# EAGLE design LED_servo_board (EAGLE 8.3.1)
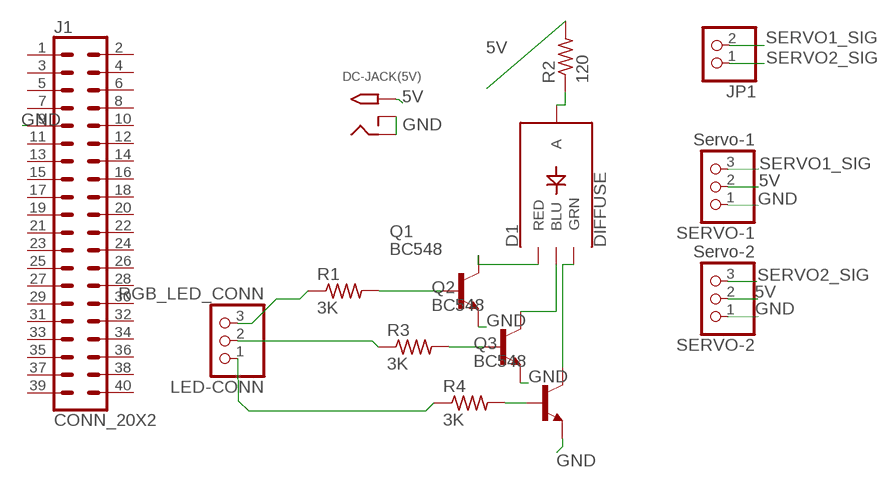
[diagram p0: schematic, sheet 1]

## Parts
D1  DIFFUSE  LED-RGB-CADIFFUSE  [LED-RGB-THRU]
DC-JACK(5V)  2.1MMJACKTHM  [PJ-102A]
J1  CONN_20X2  [2X20]
JP1  PINHD-1X2  [1X02]
LED-CONN  RGB_LED_CONN  PINHD-1X3  [1X03]
Q1  BC548  [TO92-EBC]
Q2  BC548  [TO92-EBC]
Q3  BC548  [TO92-EBC]
R1  3K  R-US_0204/5  [0204/5]
R2  120  R-US_0204/5  [0204/5]
R3  3K  R-US_0204/5  [0204/5]
R4  3K  R-US_0204/5  [0204/5]
SERVO-1  Servo-1  PINHD-1X3  [1X03]
SERVO-2  Servo-2  PINHD-1X3  [1X03]

## Nets
5V: DC-JACK(5V).TIP R2.2 SERVO-1.2 SERVO-2.2
GND: DC-JACK(5V).RING DC-JACK(5V).RING_SW J1.9 Q1.E Q2.E Q3.E SERVO-1.1 SERVO-2.1
N$1: Q1.B R1.2
N$2: Q2.B R3.2
N$3: Q3.B R4.2
N$4: D1.1(RED) Q1.C
N$5: D1.4(BLU) Q2.C
N$6: D1.3(GRN) Q3.C
N$7: D1.2(A) R2.1
N$8: LED-CONN.3 R1.1
N$9: LED-CONN.2 R3.1
N$10: LED-CONN.1 R4.1
SERVO1_SIG: JP1.2 SERVO-1.3
SERVO2_SIG: JP1.1 SERVO-2.3
Unconnected: J1.1 J1.2 J1.3 J1.4 J1.5 J1.6 J1.7 J1.8 J1.10 J1.11 J1.12 J1.13 J1.14 J1.15 J1.16 J1.17 J1.18 J1.19 J1.20 J1.21 J1.22 J1.23 J1.24 J1.25 J1.26 J1.27 J1.28 J1.29 J1.30 J1.31 J1.32 J1.33 J1.34 J1.35 J1.36 J1.37 J1.38 J1.39 J1.40

## Library data of the parts
D1 = SparkFun-LED:LED-RGB-CA: LED-RGB Diffused Common Anode Packages: LED RGB-THRU P-LCC-4-3 LED-TRICOLOR-SMD SparkFun Products: RGB Diffused Common Anode- Diffuse <[https://www.sparkfun.com/products/10821]> RGB Diffused Common Anode - Clear <[https://www.sparkfun.com/products/10820]> Qduino Mini <[https://www.sparkfun.com/products/13614]> Triple Output LED RGB - SMD <https://www.sparkfun.com/products/7844>; PROD_ID: DIO-10632
DC-JACK(5V) = adafruit:2.1MMJACK: 2.1mm x 5.5mm THM DC jack with internal switch. Digikey part #PJ-102A, 4UCON part #05537 2.1mm x 5.5mm SMT DC jack with internal switch. Digikey part #PJ-002A-SMT, 4UCON part #03267 By microbuilder.eu & adafruit.com
J1 = SparkFun-Connectors:CONN_20X2: Multi connection point. Often used as Generic Header-pin footprint for 0.1 inch spaced/style header connections On any of the 0.1 inch spaced packages, you can populate with these: Break Away Headers - Straight <https://www.sparkfun.com/products/116> (PRT-00116) Break Away Male Headers - Right Angle <https://www.sparkfun.com/products/553> (PRT-00553) Female Headers <https://www.sparkfun.com/products/115> (PRT-00115) Break Away Headers - Machine Pin <https://www.sparkfun.com/products/117> (PRT-00117) Break Away Female Headers - Swiss Machine Pin <https://www.sparkfun.com/products/743> (PRT-00743)
JP1 = pinhead:PINHD-1X2: PIN HEADER
LED-CONN SERVO-1 SERVO-2 = pinhead:PINHD-1X3: PIN HEADER
Q1-Q3 = transistor-npn:BC548*: NPN Transistor
R1-R4 = resistor:R-US_: RESISTOR, American symbol

## Board
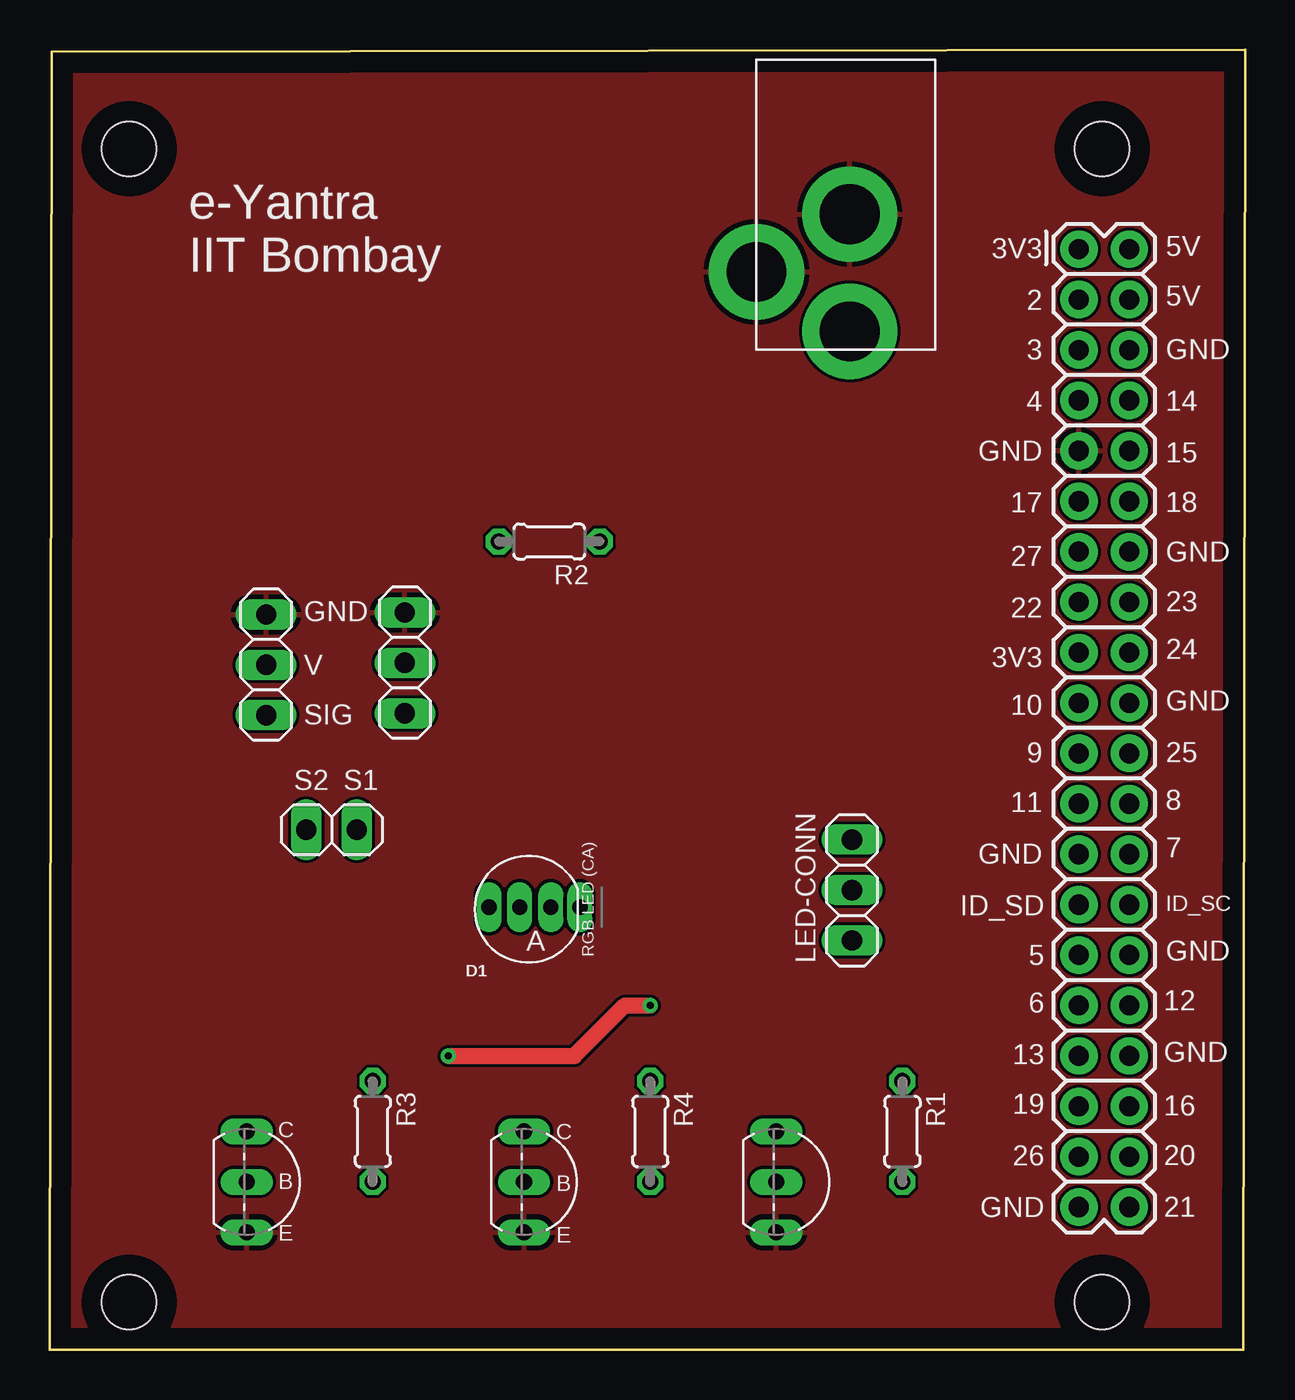
[diagram p1: board, top side]
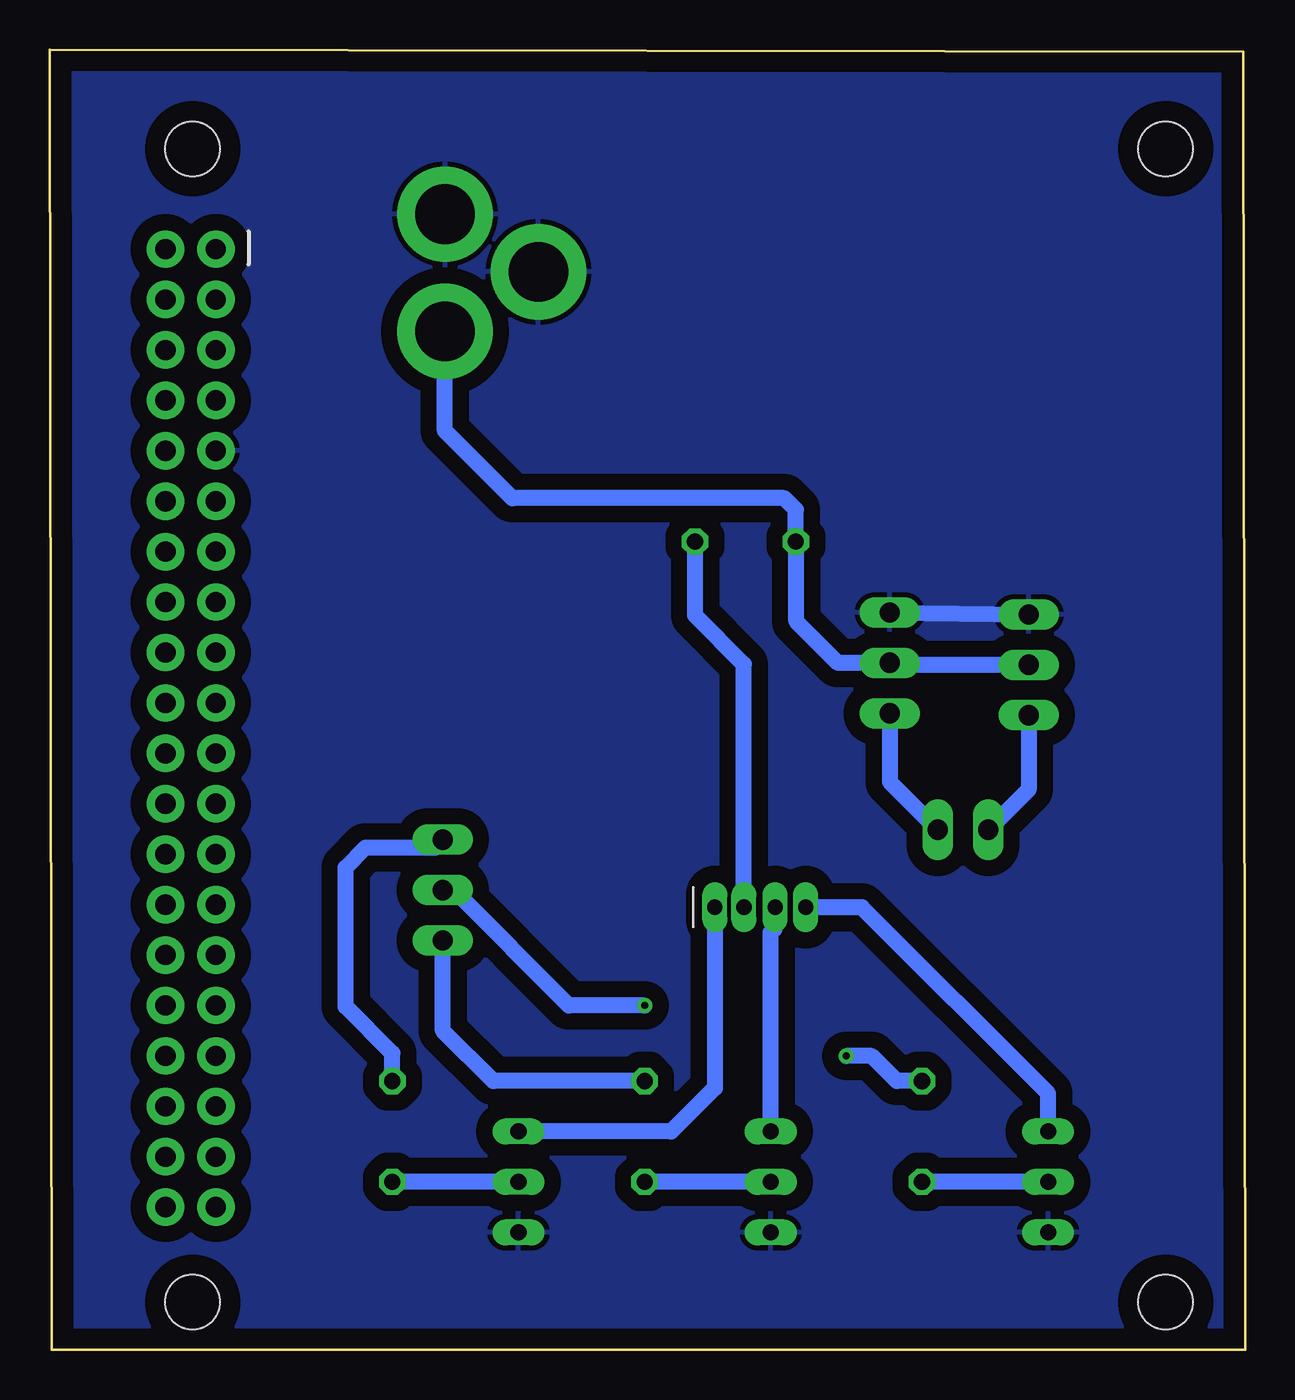
[diagram p2: board, bottom side, seen from below]

Size 60.2 x 65.5 mm. Coordinates in mm from the lower left corner, seen from the top.
Outline: 0.1,65.4 60.2,65.5 60.1,0 0,0 0.1,65.4
Copper layers (1*16): Top 0.035mm / dielectric 1.5mm / Bottom 0.035mm
Design rules "default": minimum track width 6mil, minimum drill 0.35mm, track to track 6mil, track to pad 6mil, pad to pad 6mil, via to via 6mil, smd to smd 6mil, copper to edge 40mil, drill to drill 6mil, minimum pad ring 10mil, minimum via ring 8mil, stop-mask expansion 4mil, vias tented up to drill 0mil, thermal gap 10mil
Holes 2.75 mm at 4,60.5 4,60.5 53,60.5 53,2.4 4,2.4

### Footprints (pad centres in the part's own frame; a part is rotated, then mirrored left to right if it is on the bottom)
LED-RGB-THRU = drill 0.762 pad 0.889 long: 1 1.405,0; 2 -0.065,0; 3 -1.635,0; 4 -3.175,0
PJ-102A = drill 3 pad 4.8: RING 0.1,-3.39; RING_SW -4.6,-6.29; TIP 0.1,-9.29
2X20 = drill 1.016 pad 1.88: 1 0,0; 2 0,2.54; 3 2.54,0; 4 2.54,2.54; 5 5.08,0; 6 5.08,2.54; 7 7.62,0; 8 7.62,2.54; 9 10.16,0; 10 10.16,2.54; 11 12.7,0; 12 12.7,2.54; 13 15.24,0; 14 15.24,2.54; 15 17.78,0; 16 17.78,2.54; 17 20.32,0; 18 20.32,2.54; 19 22.86,0; 20 22.86,2.54; 21 25.4,0; 22 25.4,2.54; 23 27.94,0; 24 27.94,2.54; 25 30.48,0; 26 30.48,2.54; 27 33.02,0; 28 33.02,2.54; 29 35.56,0; 30 35.56,2.54; 31 38.1,0; 32 38.1,2.54; 33 40.64,0; 34 40.64,2.54; 35 43.18,0; 36 43.18,2.54; 37 45.72,0; 38 45.72,2.54; 39 48.26,0; 40 48.26,2.54
1X02 = drill 1.016 long: 1 -1.27,0; 2 1.27,0
1X03 = drill 1.016 long: 1 -2.54,0; 2 0,0; 3 2.54,0
TO92-EBC = drill 0.813 long: B 0,-1.27; C -2.54,-1.27; E 2.54,-1.27
0204/5 = drill 0.813 octagon: 1 -2.54,0; 2 2.54,0

### Placement (x,y rotation side)
D1  25.3,22.3 0 top
DC-JACK(5V)  40.19,60.6 0 top
J1  51.83,55.45 270 top
JP1  14.2,26.2 0 top
LED-CONN  40.4,23.16 90 top
Q1  37.86,8.46 270 top
Q2  11.19,8.46 270 top
Q3  25.16,8.46 270 top
R1  42.94,11 270 top
R2  25.16,40.72 180 top
R3  16.27,11 270 top
R4  30.24,11 270 top
SERVO-1  17.89,34.61 270 top
SERVO-2  10.9,34.51 270 top

### Tracks (layer width: path | path; a pad name or v marks a point on that pad's centre or on a via)
5V
  Bottom 0.813: SERVO-2.2 17.79,34.51 SERVO-1.2 20.51,34.61 22.6,36.7 22.6,40.7 R2.2 22.62,42.32 23.2,42.9 36.9,42.9 40.3,46.3 DC-JACK(5V).TIP
GND
  Bottom 0.813: SERVO-1.1 SERVO-2.1
  pour Top: 0.3,65.2 59.7,65.2 59.7,0.6 0.3,0.6
  pour Bottom (isolate 0.813): 0.2,65.2 60,65.2 59.8,0.1 0.1,0.1
N$1
  Bottom 0.813: Q1.B R1.2
N$2
  Bottom 0.813: Q2.B R3.2
N$3
  Bottom 0.813: Q3.B R4.2
N$4
  Bottom 0.813: D1.1 26.71,13.19 28.9,11 Q1.C
N$5
  Bottom 0.813: Q2.C 9.92,12.92 19.3,22.3 D1.4
N$6
  Bottom 0.813: Q3.C 23.89,21.01 23.7,21.2 23.7,22.27 D1.3
N$7
  Bottom 0.813: D1.2 25.23,34.53 27.7,37 R2.1
N$8
  Bottom 0.813: R1.1 42.94,14.94 45.3,17.3 45.3,24.3 44.3,25.3 40.8,25.3 LED-CONN.3
N$9  (via drill 0.35)
  Top 0.813: v20.08,14.81 26.43,14.81 28.97,17.35 v30.24,17.35
  Bottom 0.813: R3.1 17.54,13.54 18.81,14.81 v20.08,14.81 | v30.24,17.35 34.05,17.35 39.86,23.16 LED-CONN.2
N$10
  Bottom 0.813: R4.1 37.86,13.54 40.4,16.08 LED-CONN.1
SERVO1_SIG
  Bottom 0.813: SERVO-1.3 17.89,28.62 JP1.2
SERVO2_SIG
  Bottom 0.813: SERVO-2.3 10.9,28.23 JP1.1

### Text on the board
tNames: 3V3 | 5V | e-Yantra / IIT Bombay | 2 | 5V | 3 | GND | 4 | 14 | GND | 15 | 17 | 18 | 27 | GND | 22 | 23 | GND | 3V3 | 24 | V | 10 | GND | SIG | 9 | 25 | S2 | S1 | 11 | 8 | GND | 7 | ID_SD | ID_SC | A | 5 | RGB LED (CA) | GND | 6 | 12 | 13 | GND | 19 | 16 | C | C | 26 | 20 | B | B | GND | 21 | E | E